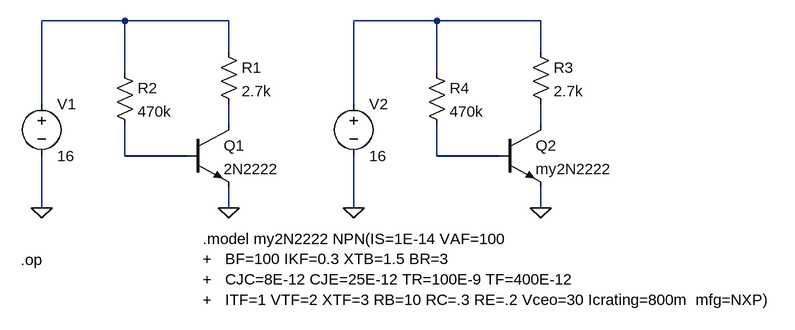
[diagram p0: schematic ModificandoBetaModelo2N2222.asc]
ModificandoBetaModelo2N2222.asc, the LTspice schematic file:
Version 4
SHEET 1 1140 680
WIRE 64 -32 -64 -32
WIRE 224 -32 64 -32
WIRE 544 -32 416 -32
WIRE 704 -32 544 -32
WIRE 224 16 224 -32
WIRE 704 16 704 -32
WIRE 64 48 64 -32
WIRE 544 48 544 -32
WIRE -64 96 -64 -32
WIRE 416 96 416 -32
WIRE 224 128 224 96
WIRE 704 128 704 96
WIRE 64 176 64 128
WIRE 160 176 64 176
WIRE 544 176 544 128
WIRE 640 176 544 176
WIRE -64 256 -64 176
WIRE 224 256 224 224
WIRE 416 256 416 176
WIRE 704 256 704 224
FLAG 224 256 0
FLAG -64 256 0
FLAG 704 256 0
FLAG 416 256 0
SYMBOL res 208 0 R0
SYMATTR InstName R1
SYMATTR Value 2.7k
SYMBOL res 48 32 R0
SYMATTR InstName R2
SYMATTR Value 470k
SYMBOL voltage -64 80 R0
SYMATTR InstName V1
SYMATTR Value 16
SYMBOL res 688 0 R0
SYMATTR InstName R3
SYMATTR Value 2.7k
SYMBOL res 528 32 R0
SYMATTR InstName R4
SYMATTR Value 470k
SYMBOL voltage 416 80 R0
SYMATTR InstName V2
SYMATTR Value 16
SYMBOL npn 160 128 R0
SYMATTR InstName Q1
SYMATTR Value 2N2222
SYMBOL npn 640 128 R0
SYMATTR InstName Q2
SYMATTR Value my2N2222
TEXT -96 336 Left 2 !.op
TEXT 184 304 Left 2 !.model my2N2222 NPN(IS=1E-14 VAF=100\n+   BF=100 IKF=0.3 XTB=1.5 BR=3\n+   CJC=8E-12 CJE=25E-12 TR=100E-9 TF=400E-12\n+   ITF=1 VTF=2 XTF=3 RB=10 RC=.3 RE=.2 Vceo=30 Icrating=800m  mfg=NXP)

The netlist it stands for:
* ModificandoBetaModelo2N2222.asc
R1 N001 N003 2.7k
R2 N001 N005 470k
V1 N001 0 16
R3 N002 N004 2.7k
R4 N002 N006 470k
V2 N002 0 16
Q1 N003 N005 0 0 2N2222
Q2 N004 N006 0 0 my2N2222
.model NPN NPN
.model PNP PNP
.lib standard.bjt
.op
.model my2N2222 NPN(IS=1E-14 VAF=100
+   BF=100 IKF=0.3 XTB=1.5 BR=3
+   CJC=8E-12 CJE=25E-12 TR=100E-9 TF=400E-12
+   ITF=1 VTF=2 XTF=3 RB=10 RC=.3 RE=.2 Vceo=30 Icrating=800m  mfg=NXP)
.backanno
.end